# Altium project DDR4.PrjPcb (part 2 of 2)
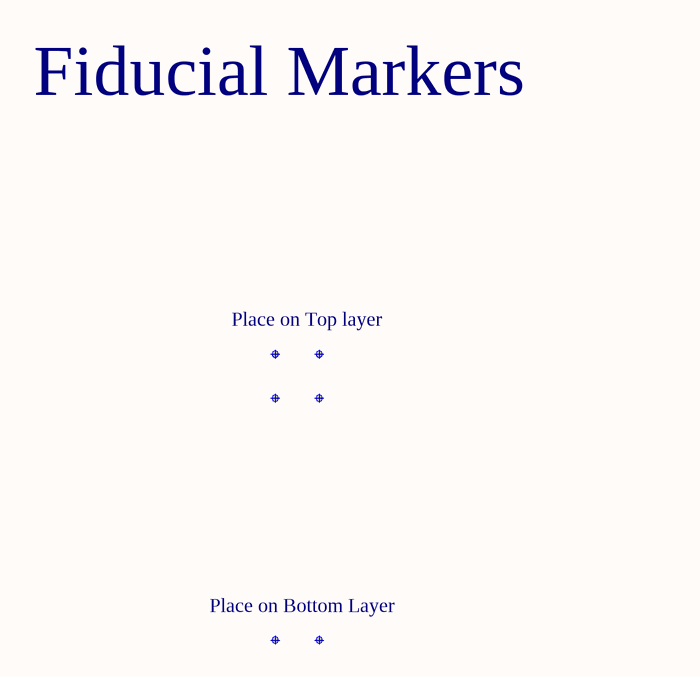
[diagram p7: Fiducial Markers.SchDoc]

## Nets that join several sheets
A0: Address Termination (R110.1), Memory Chips 5 to 8 (IC5.L3 IC6.L3 IC7.L3 IC8.L3)
A1: Address Termination (R111.1), Memory Chips 5 to 8 (IC5.L7 IC6.L7 IC7.L7 IC8.L7)
A2: Address Termination (R118.1), Memory Chips 5 to 8 (IC5.M3 IC6.M3 IC7.M3 IC8.M3)
A3: Address Termination (R124.1), Memory Chips 5 to 8 (IC5.K7 IC6.K7 IC7.K7 IC8.K7)
A4: Address Termination (R125.1), Memory Chips 5 to 8 (IC5.K3 IC6.K3 IC7.K3 IC8.K3)
A5: Address Termination (R123.1), Memory Chips 5 to 8 (IC5.L8 IC6.L8 IC7.L8 IC8.L8)
A6: Address Termination (R109.1), Memory Chips 5 to 8 (IC5.L2 IC6.L2 IC7.L2 IC8.L2)
A7: Address Termination (R117.1), Memory Chips 5 to 8 (IC5.M8 IC6.M8 IC7.M8 IC8.M8)
A8: Address Termination (R104.1), Memory Chips 5 to 8 (IC5.M2 IC6.M2 IC7.M2 IC8.M2)
A9: Address Termination (R106.1), Memory Chips 5 to 8 (IC5.M7 IC6.M7 IC7.M7 IC8.M7)
A10: Address Termination (R114.1), Memory Chips 5 to 8 (IC5.J3 IC6.J3 IC7.J3 IC8.J3)
A11: Address Termination (R105.1), Memory Chips 5 to 8 (IC5.N2 IC6.N2 IC7.N2 IC8.N2)
A12: Address Termination (R126.1), Memory Chips 5 to 8 (IC5.J7 IC6.J7 IC7.J7 IC8.J7)
A13: Address Termination (R116.1), Memory Chips 5 to 8 (IC5.N8 IC6.N8 IC7.N8 IC8.N8)
A14: Address Termination (R122.1), Memory Chips 5 to 8 (IC5.H2 IC6.H2 IC7.H2 IC8.H2)
A15: Address Termination (R120.1), Memory Chips 5 to 8 (IC5.H7 IC6.H7 IC7.H7 IC8.H7)
A16: Address Termination (R100.1), Memory Chips 5 to 8 (IC5.H8 IC6.H8 IC7.H8 IC8.H8)
ACT_B: Address Termination (R112.1), Memory Chips 5 to 8 (IC5.H3 IC6.H3 IC7.H3 IC8.H3)
ALERT_B: Memory Chips 5 to 8 (IC5.L9 IC6.L9 IC7.L9 IC8.L9), SPD and Alert (C58.1 R103.1)
BA0: Address Termination (R108.1), Memory Chips 5 to 8 (IC5.K2 IC6.K2 IC7.K2 IC8.K2)
BA1: Address Termination (R115.1), Memory Chips 5 to 8 (IC5.K8 IC6.K8 IC7.K8 IC8.K8)
BG0: Address Termination (R113.1), Memory Chips 5 to 8 (IC5.J2 IC6.J2 IC7.J2 IC8.J2)
BG1: Address Termination (R119.1), Memory Chips 5 to 8 (IC5.J8 IC6.J8 IC7.J8 IC8.J8)
CKE0: Address Termination (R101.1), Memory Chips 5 to 8 (IC5.G3 IC6.G3 IC7.G3 IC8.G3)
CLK0_N: Address Termination (C2.2 R97.1), Memory Chips 5 to 8 (IC5.F8 IC6.F8 IC7.F8 IC8.F8)
CLK0_P: Address Termination (C2.1 R98.1), Memory Chips 5 to 8 (IC5.F7 IC6.F7 IC7.F7 IC8.F7)
CS0_B: Address Termination (R121.1), Memory Chips 5 to 8 (IC5.G7 IC6.G7 IC7.G7 IC8.G7)
DM4: Memory Chips 5 to 8 (IC5.A7), Stub Termination (R28.2)
DM5: Memory Chips 5 to 8 (IC6.A7), Stub Termination (R32.2)
DM6: Memory Chips 5 to 8 (IC7.A7), Stub Termination (R36.2)
DM7: Memory Chips 5 to 8 (IC8.A7), Stub Termination (R40.2)
DQ32: Memory Chips 5 to 8 (IC5.D7), Stub Termination (R10.2)
DQ33: Memory Chips 5 to 8 (IC5.B7), Stub Termination (R14.2)
DQ34: Memory Chips 5 to 8 (IC5.D3), Stub Termination (R18.2)
DQ35: Memory Chips 5 to 8 (IC5.C2), Stub Termination (R22.2)
DQ36: Memory Chips 5 to 8 (IC5.E7), Stub Termination (R26.2)
DQ37: Memory Chips 5 to 8 (IC5.D8), Stub Termination (R30.2)
DQ38: Memory Chips 5 to 8 (IC5.E3), Stub Termination (R34.2)
DQ39: Memory Chips 5 to 8 (IC5.D2), Stub Termination (R38.2)
DQ40: Memory Chips 5 to 8 (IC6.D7), Stub Termination (R42.2)
DQ41: Memory Chips 5 to 8 (IC6.B7), Stub Termination (R45.2)
DQ42: Memory Chips 5 to 8 (IC6.D3), Stub Termination (R48.2)
DQ43: Memory Chips 5 to 8 (IC6.C2), Stub Termination (R51.2)
DQ44: Memory Chips 5 to 8 (IC6.E7), Stub Termination (R54.2)
DQ45: Memory Chips 5 to 8 (IC6.D8), Stub Termination (R57.2)
DQ46: Memory Chips 5 to 8 (IC6.E3), Stub Termination (R60.2)
DQ47: Memory Chips 5 to 8 (IC6.D2), Stub Termination (R63.2)
DQ48: Memory Chips 5 to 8 (IC7.D7), Stub Termination (R66.2)
DQ49: Memory Chips 5 to 8 (IC7.B7), Stub Termination (R68.2)
DQ50: Memory Chips 5 to 8 (IC7.D3), Stub Termination (R70.2)
DQ51: Memory Chips 5 to 8 (IC7.C2), Stub Termination (R72.2)
DQ52: Memory Chips 5 to 8 (IC7.E7), Stub Termination (R74.2)
DQ53: Memory Chips 5 to 8 (IC7.D8), Stub Termination (R76.2)
DQ54: Memory Chips 5 to 8 (IC7.E3), Stub Termination (R78.2)
DQ55: Memory Chips 5 to 8 (IC7.D2), Stub Termination (R80.2)
DQ56: Memory Chips 5 to 8 (IC8.D7), Stub Termination (R82.2)
DQ57: Memory Chips 5 to 8 (IC8.B7), Stub Termination (R84.2)
DQ58: Memory Chips 5 to 8 (IC8.D3), Stub Termination (R86.2)
DQ59: Memory Chips 5 to 8 (IC8.C2), Stub Termination (R88.2)
DQ60: Memory Chips 5 to 8 (IC8.E7), Stub Termination (R90.2)
DQ61: Memory Chips 5 to 8 (IC8.D8), Stub Termination (R92.2)
DQ62: Memory Chips 5 to 8 (IC8.E3), Stub Termination (R94.2)
DQ63: Memory Chips 5 to 8 (IC8.D2), Stub Termination (R96.2)
DQS4_N: Memory Chips 5 to 8 (IC5.B3), Stub Termination (R43.2)
DQS4_P: Memory Chips 5 to 8 (IC5.C3), Stub Termination (R46.2)
DQS5_N: Memory Chips 5 to 8 (IC6.B3), Stub Termination (R49.2)
DQS5_P: Memory Chips 5 to 8 (IC6.C3), Stub Termination (R52.2)
DQS6_N: Memory Chips 5 to 8 (IC7.B3), Stub Termination (R55.2)
DQS6_P: Memory Chips 5 to 8 (IC7.C3), Stub Termination (R58.2)
DQS7_N: Memory Chips 5 to 8 (IC8.B3), Stub Termination (R61.2)
DQS7_P: Memory Chips 5 to 8 (IC8.C3), Stub Termination (R64.2)
ODT0: Address Termination (R102.1), Memory Chips 5 to 8 (IC5.F3 IC6.F3 IC7.F3 IC8.F3)
PARITY: Address Termination (R107.1), Memory Chips 5 to 8 (IC5.N3 IC6.N3 IC7.N3 IC8.N3)
VDD: Address Termination (C1.2), Decap (47 pins), Memory Chips 5 to 8 (56 pins), SPD and Alert (R103.2)
VDDSPD: Decap (C5.1), SPD and Alert (IC9.8)
VPP: Decap (10 pins), Memory Chips 5 to 8 (8 pins)
VREFCA: Decap (10 pins), Memory Chips 5 to 8 (IC5.J1 IC6.J1 IC7.J1 IC8.J1)
VSS: Calibration (8 pins), Decap (37 pins), Memory Chips 5 to 8 (52 pins), SPD and Alert (C58.2 IC9.4)
VTT: Address Termination (26 pins), Decap (11 pins)
ZQ_U5: Calibration (R5.1), Memory Chips 5 to 8 (IC5.B9)
ZQ_U6: Calibration (R6.1), Memory Chips 5 to 8 (IC6.B9)
ZQ_U7: Calibration (R7.1), Memory Chips 5 to 8 (IC7.B9)
ZQ_U8: Calibration (R8.1), Memory Chips 5 to 8 (IC8.B9)